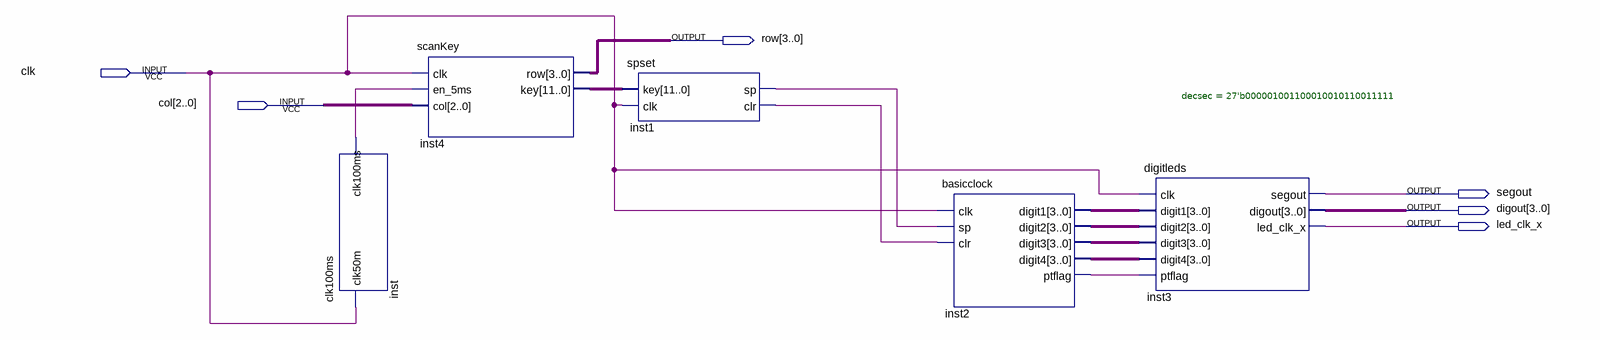
[diagram p0: schematic sheet]
// Quartus schematic stopwatch.bdf as structural Verilog: 5 symbols, 6 pins
module stopwatch (
  input  clk,
  input  [2:0] col,
  output [3:0] row,
  output segout,
  output [3:0] digout,
  output led_clk_x
);

  wire inst1_clr, inst1_sp, inst2_ptflag, inst_clk100ms;
  wire [3:0] inst2_digit1, inst2_digit2, inst2_digit3, inst2_digit4;
  wire [11:0] inst4_key;

  clk100ms inst (.clk50m(clk), .clk100ms(inst_clk100ms));
  scanKey inst4 (.clk(clk), .en_5ms(inst_clk100ms), .col(col), .row(row), .key(inst4_key));
  spset inst1 (.key(inst4_key), .clk(clk), .sp(inst1_sp), .clr(inst1_clr));
  basicclock #(.decsec(27'b000001001100010010110011111)) inst2 (
    .clk(clk), .sp(inst1_sp), .clr(inst1_clr), .digit1(inst2_digit1), .digit2(inst2_digit2),
    .digit3(inst2_digit3), .digit4(inst2_digit4), .ptflag(inst2_ptflag));
  digitleds inst3 (
    .clk(clk), .digit1(inst2_digit1), .digit2(inst2_digit2), .digit3(inst2_digit3), .digit4(inst2_digit4),
    .ptflag(inst2_ptflag), .segout(segout), .digout(digout), .led_clk_x(led_clk_x));
endmodule
